# EAGLE design Control board self routed (EAGLE 9.6.2)
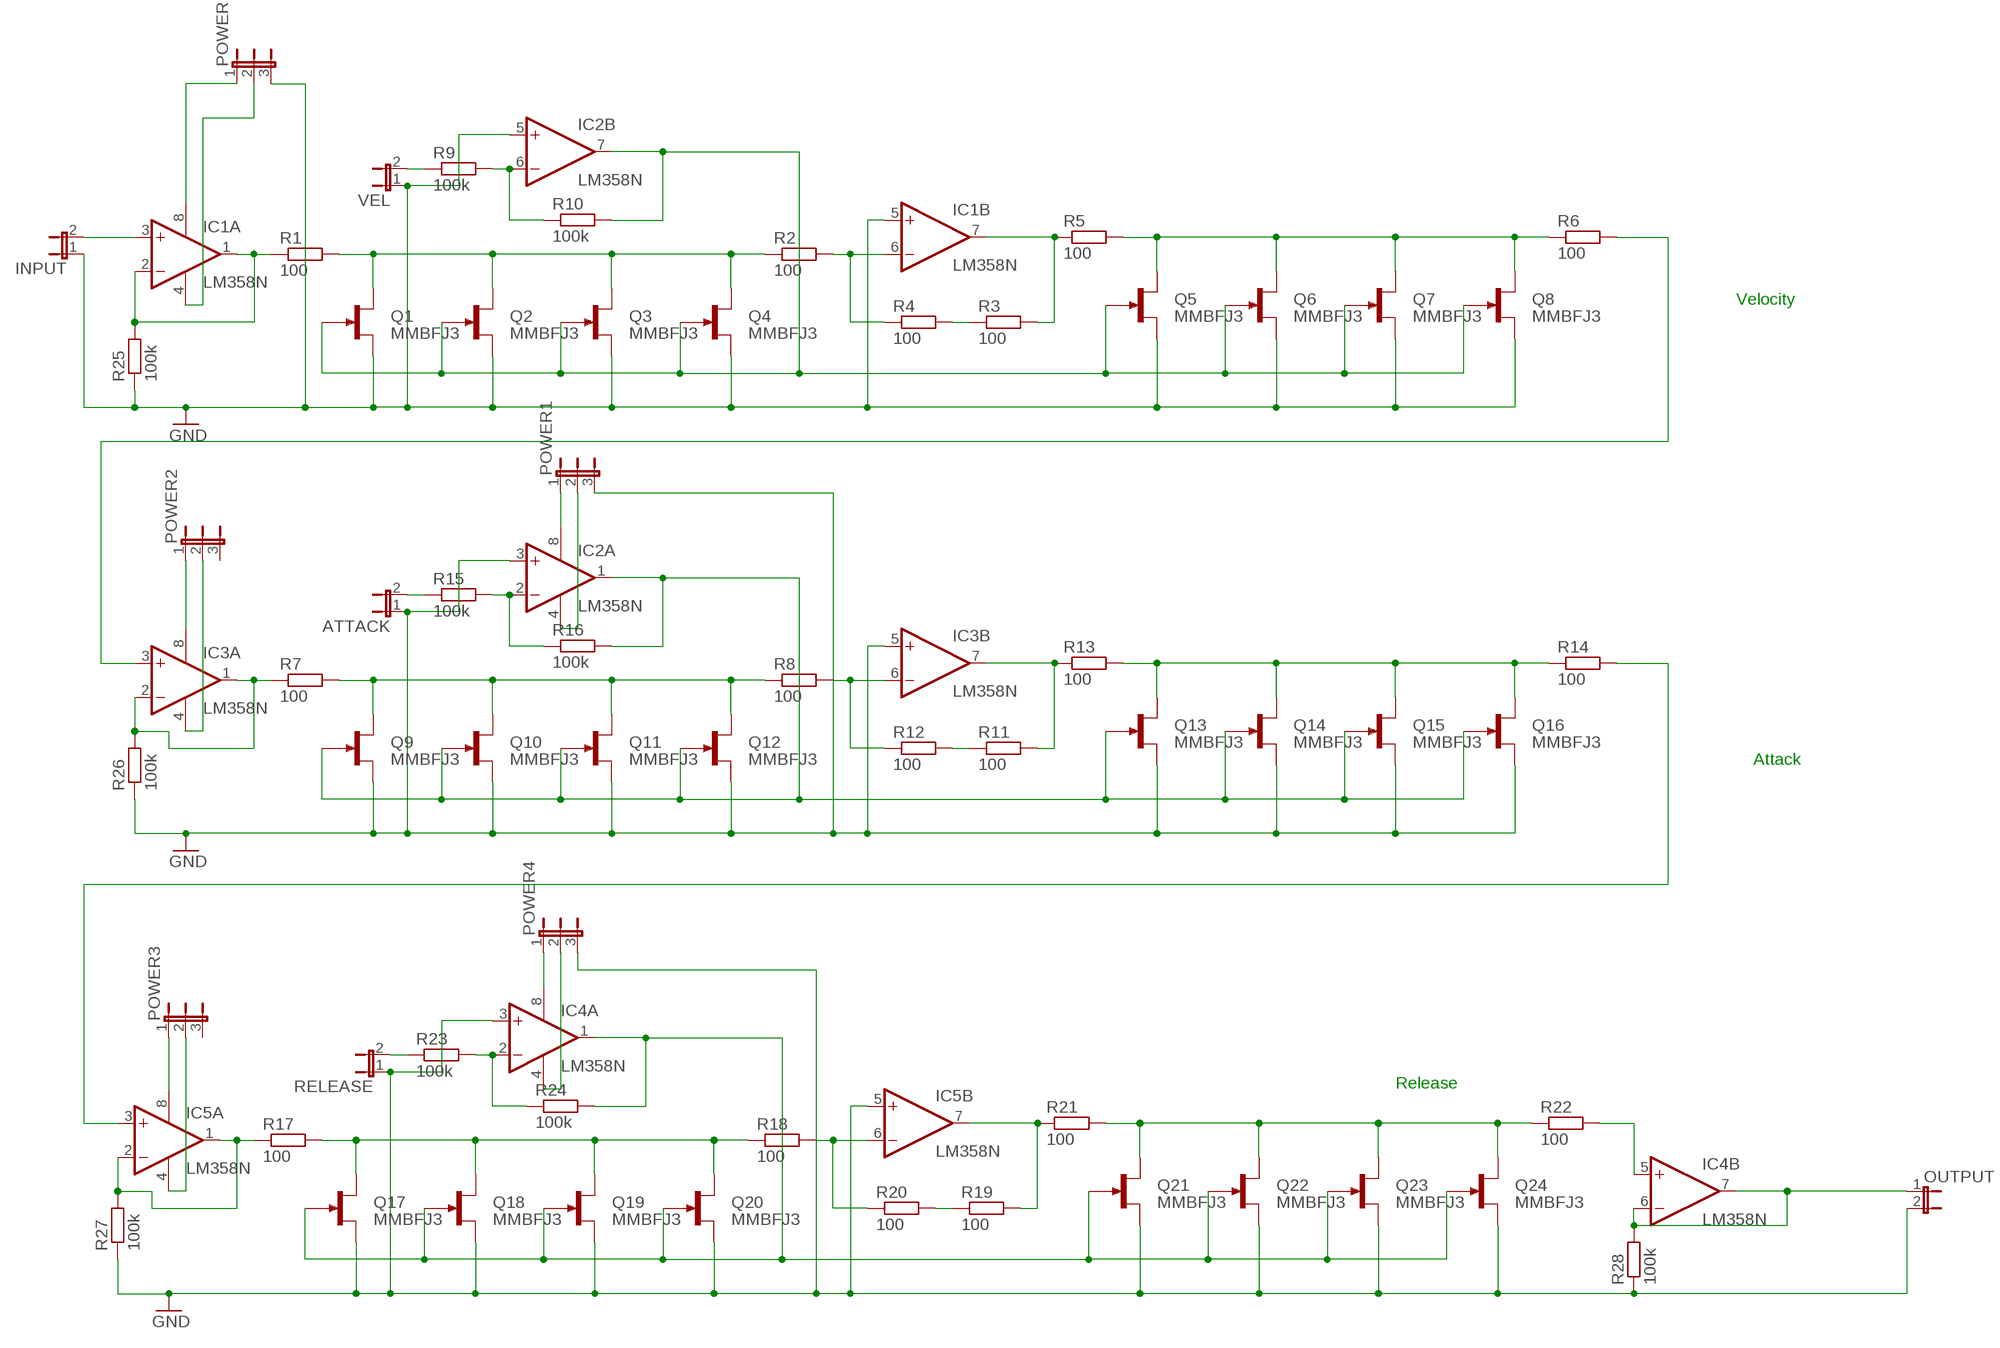
[diagram p0: schematic, sheet 1]

## Parts
ATTACK  JP1E  [JP1]
IC1  LM358N  [DIL08]
IC2  LM358N  [DIL08]
IC3  LM358N  [DIL08]
IC4  LM358N  [DIL08]
IC5  LM358N  [DIL08]
INPUT  JP1E  [JP1]
OUTPUT  JP1E  [JP1]
POWER  JP2E  [JP2]
POWER1  JP2E  [JP2]
POWER2  JP2E  [JP2]
POWER3  JP2E  [JP2]
POWER4  JP2E  [JP2]
Q1  MMBFJ3  [SOT23]
Q2  MMBFJ3  [SOT23]
Q3  MMBFJ3  [SOT23]
Q4  MMBFJ3  [SOT23]
Q5  MMBFJ3  [SOT23]
Q6  MMBFJ3  [SOT23]
Q7  MMBFJ3  [SOT23]
Q8  MMBFJ3  [SOT23]
Q9  MMBFJ3  [SOT23]
Q10  MMBFJ3  [SOT23]
Q11  MMBFJ3  [SOT23]
Q12  MMBFJ3  [SOT23]
Q13  MMBFJ3  [SOT23]
Q14  MMBFJ3  [SOT23]
Q15  MMBFJ3  [SOT23]
Q16  MMBFJ3  [SOT23]
Q17  MMBFJ3  [SOT23]
Q18  MMBFJ3  [SOT23]
Q19  MMBFJ3  [SOT23]
Q20  MMBFJ3  [SOT23]
Q21  MMBFJ3  [SOT23]
Q22  MMBFJ3  [SOT23]
Q23  MMBFJ3  [SOT23]
Q24  MMBFJ3  [SOT23]
R1  100  R-EU_0204/7  [0204/7]
R2  100  R-EU_0204/7  [0204/7]
R3  100  R-EU_0204/7  [0204/7]
R4  100  R-EU_0204/7  [0204/7]
R5  100  R-EU_0204/7  [0204/7]
R6  100  R-EU_0204/7  [0204/7]
R7  100  R-EU_0204/7  [0204/7]
R8  100  R-EU_0204/7  [0204/7]
R9  100k  R-EU_0204/7  [0204/7]
R10  100k  R-EU_0204/7  [0204/7]
R11  100  R-EU_0204/7  [0204/7]
R12  100  R-EU_0204/7  [0204/7]
R13  100  R-EU_0204/7  [0204/7]
R14  100  R-EU_0204/7  [0204/7]
R15  100k  R-EU_0204/7  [0204/7]
R16  100k  R-EU_0204/7  [0204/7]
R17  100  R-EU_0204/7  [0204/7]
R18  100  R-EU_0204/7  [0204/7]
R19  100  R-EU_0204/7  [0204/7]
R20  100  R-EU_0204/7  [0204/7]
R21  100  R-EU_0204/7  [0204/7]
R22  100  R-EU_0204/7  [0204/7]
R23  100k  R-EU_0204/7  [0204/7]
R24  100k  R-EU_0204/7  [0204/7]
R25  100k  R-EU_0204/7  [0204/7]
R26  100k  R-EU_0204/7  [0204/7]
R27  100k  R-EU_0204/7  [0204/7]
R28  100k  R-EU_0204/7  [0204/7]
RELEASE  JP1E  [JP1]
VEL  JP1E  [JP1]

## Nets
22: Q13.1(D) Q14.1(D) Q15.1(D) Q16.1(D) R13.2 R14.1
CONTROL: IC2.7(B:OUT) Q1.3(G) Q2.3(G) Q3.3(G) Q4.3(G) Q5.3(G) Q6.3(G) Q7.3(G) Q8.3(G) R10.2
CONTROL1: IC2.1(A:OUT) Q9.3(G) Q10.3(G) Q11.3(G) Q12.3(G) Q13.3(G) Q14.3(G) Q15.3(G) Q16.3(G) R16.2
CONTROL2: IC4.1(A:OUT) Q17.3(G) Q18.3(G) Q19.3(G) Q20.3(G) Q21.3(G) Q22.3(G) Q23.3(G) Q24.3(G) R24.2
GND: ATTACK.1 IC1.5(B:+IN) IC2.3(A:+IN) IC2.5(B:+IN) IC3.5(B:+IN) IC4.3(A:+IN) IC5.5(B:+IN) INPUT.1 OUTPUT.2 POWER1.3 POWER4.3 POWER.3 Q1.2(S) Q2.2(S) Q3.2(S) Q4.2(S) Q5.2(S) Q6.2(S) Q7.2(S) Q8.2(S) Q9.2(S) Q10.2(S) Q11.2(S) Q12.2(S) Q13.2(S) Q14.2(S) Q15.2(S) Q16.2(S) Q17.2(S) Q18.2(S) Q19.2(S) Q20.2(S) Q21.2(S) Q22.2(S) Q23.2(S) Q24.2(S) R25.1 R26.1 R27.1 R28.1 RELEASE.1 VEL.1
N$1: IC4.8(P:V+) POWER4.1
N$2: IC1.8(P:V+) POWER.1
N$3: IC1.6(B:-IN) R2.2 R4.1
N$4: IC1.1(A:OUT) IC1.2(A:-IN) R1.1 R25.2
N$5: R3.1 R4.2
N$6: IC4.4(P:V-) POWER4.2
N$7: IC1.7(B:OUT) R3.2 R5.1
N$8: R9.1 VEL.2
N$9: IC5.1(A:OUT) IC5.2(A:-IN) R17.1 R27.2
N$10: IC1.3(A:+IN) INPUT.2
N$11: IC5.8(P:V+) POWER3.1
N$12: IC2.6(B:-IN) R9.2 R10.1
N$13: IC4.6(B:-IN) IC4.7(B:OUT) OUTPUT.1 R28.2
N$14: IC5.4(P:V-) POWER3.2
N$15: IC3.6(B:-IN) R8.2 R12.1
N$16: R11.1 R12.2
N$17: IC3.7(B:OUT) R11.2 R13.1
N$18: IC3.8(P:V+) POWER2.1
N$19: IC4.5(B:+IN) R22.2
N$20: ATTACK.2 R15.1
N$21: IC2.2(A:-IN) R15.2 R16.1
N$22: IC3.4(P:V-) POWER2.2
N$23: IC2.8(P:V+) POWER1.1
N$24: IC1.4(P:V-) POWER.2
N$25: IC2.4(P:V-) POWER1.2
N$26: IC5.6(B:-IN) R18.2 R20.1
N$27: R19.1 R20.2
N$28: IC5.7(B:OUT) R19.2 R21.1
N$30: IC3.3(A:+IN) R6.2
N$31: R23.1 RELEASE.2
N$32: IC4.2(A:-IN) R23.2 R24.1
N$33: IC5.3(A:+IN) R14.2
N$34: IC3.1(A:OUT) IC3.2(A:-IN) R7.1 R26.2
NET11: Q1.1(D) Q2.1(D) Q3.1(D) Q4.1(D) R1.2 R2.1
NET12: Q5.1(D) Q6.1(D) Q7.1(D) Q8.1(D) R5.2 R6.1
NET21: Q9.1(D) Q10.1(D) Q11.1(D) Q12.1(D) R7.2 R8.1
NET31: Q17.1(D) Q18.1(D) Q19.1(D) Q20.1(D) R17.2 R18.1
NET32: Q21.1(D) Q22.1(D) Q23.1(D) Q24.1(D) R21.2 R22.1
Unconnected: POWER2.3 POWER3.3

## Notes on the sheet
- Velocity
- Attack
- Release

## Library data of the parts
ATTACK INPUT OUTPUT RELEASE VEL = jumper:JP1E: JUMPER
IC1-IC5 = linear:LM358: OP AMP also LM158; LM258; LM2904 Source: http://cache.national.com/ds/LM/LM158.pdf
POWER POWER1-POWER4 = jumper:JP2E: JUMPER
Q1-Q24 = transistor-small-signal:MMBFJ3*: N-Channel RF Amplifier Source: http://www.fairchildsemi.com/pf/J3/J310.html
R1-R28 = rcl:R-EU_: RESISTOR, European symbol; SPICEPREFIX: R

## Board
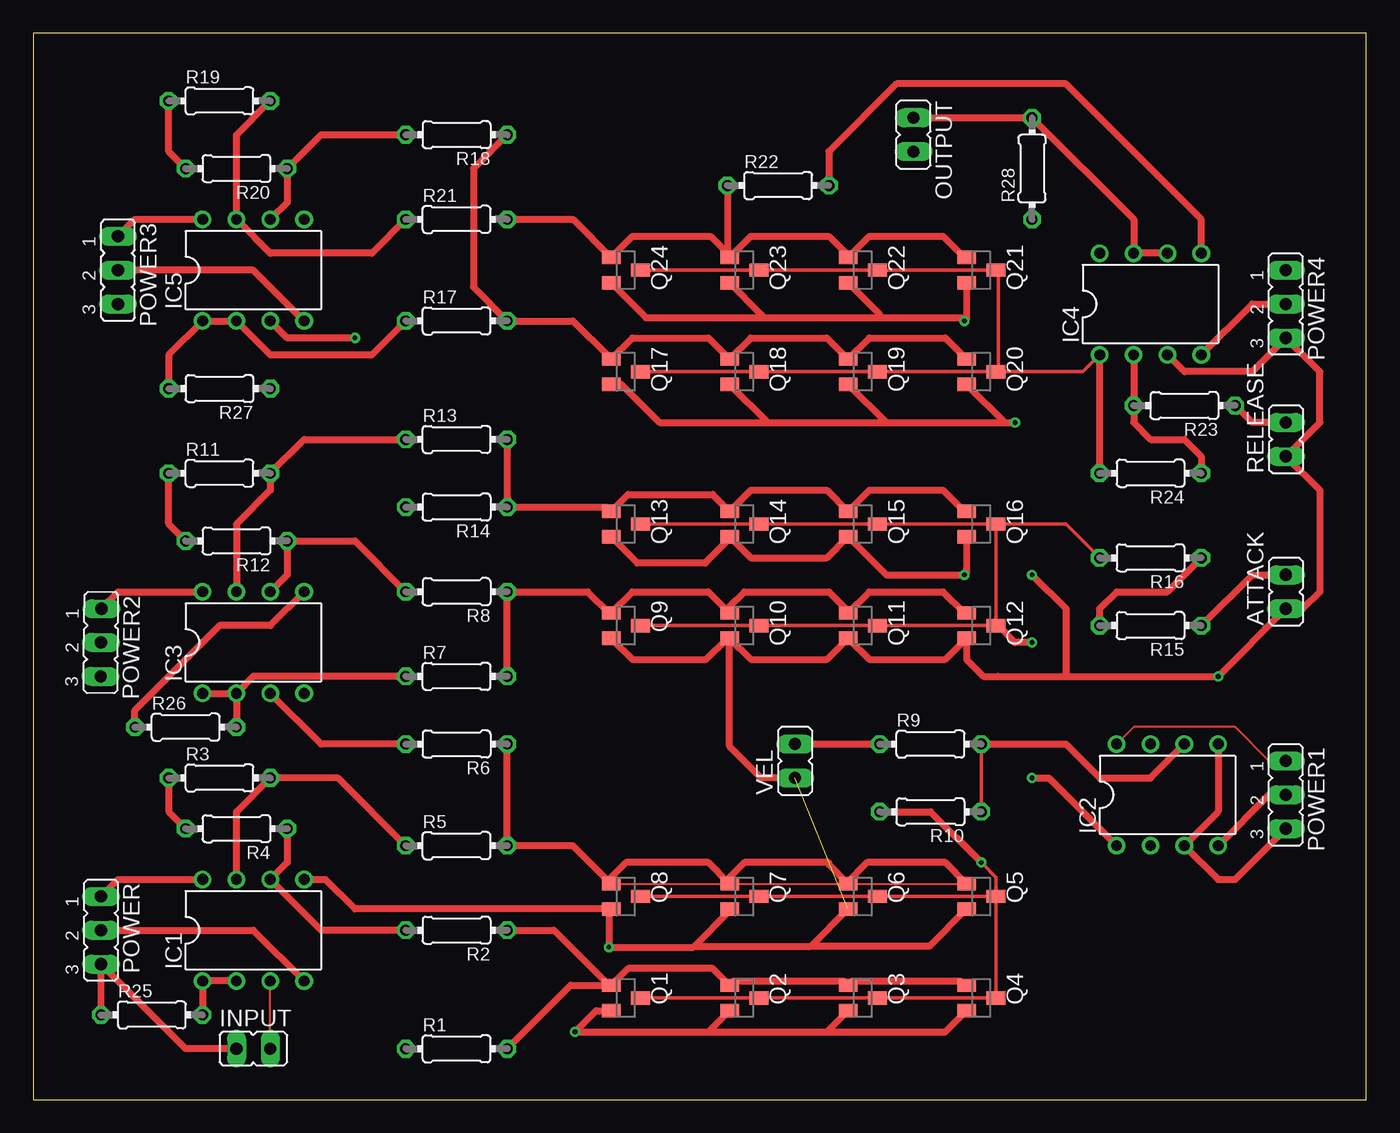
[diagram p1: board, top side]
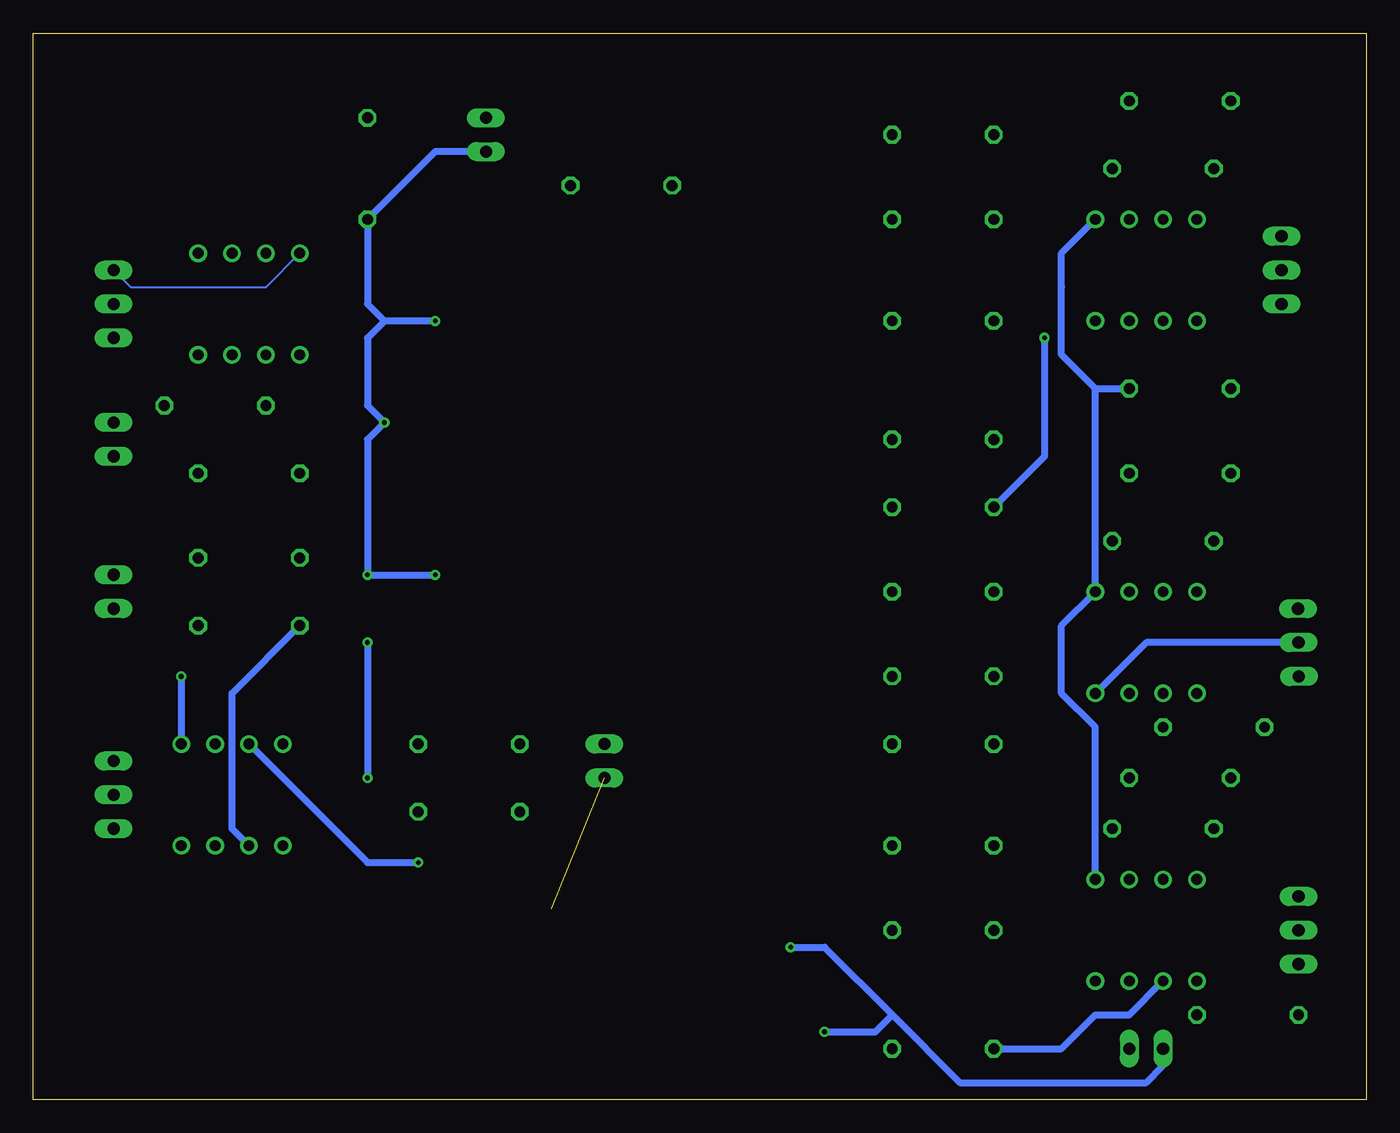
[diagram p2: board, bottom side, seen from below]

Size 100 x 80 mm. Coordinates in mm from the lower left corner, seen from the top.
Outline: 0,0 100,0 100,80 0,80 0,0
Copper layers (1*16): Top 0.035mm / dielectric 1.5mm / Bottom 0.035mm
Design rules "default": minimum track width 6mil, minimum drill 0.35mm, track to track 6mil, track to pad 6mil, pad to pad 6mil, via to via 6mil, smd to smd 6mil, copper to edge 40mil, drill to drill 6mil, minimum pad ring 10mil, minimum via ring 8mil, stop-mask expansion 4mil, vias tented up to drill 0mil, thermal gap 10mil

### Footprints (pad centres in the part's own frame; a part is rotated, then mirrored left to right if it is on the bottom)
JP1 = drill 0.914 long: 1 0,-1.27; 2 0,1.27
DIL08 = drill 0.813 pad 1.27: 1 -3.81,-3.81; 2 -1.27,-3.81; 3 1.27,-3.81; 4 3.81,-3.81; 5 3.81,3.81; 6 1.27,3.81; 7 -1.27,3.81; 8 -3.81,3.81
JP2 = drill 0.914 long: 1 -2.54,0; 2 0,0; 3 2.54,0
SOT23 = smd 1 x 1.4: 1 -0.95,-1.1; 2 0.95,-1.1; 3 0,1.1
0204/7 = drill 0.813 octagon: 1 -3.81,0; 2 3.81,0

### Placement (x,y rotation side)
ATTACK  93.98,38.1 0 top
IC1  16.51,12.7 0 top
IC2  85.09,22.86 0 top
IC3  16.51,34.29 0 top
IC4  83.82,59.69 0 top
IC5  16.51,62.23 0 top
INPUT  16.51,3.81 270 top
OUTPUT  66.04,72.39 180 top
POWER  5.08,12.7 270 top
POWER1  93.98,22.86 270 top
POWER2  5.08,34.29 269.4 top
POWER3  6.35,62.23 270 top
POWER4  93.98,59.69 270 top
Q1  44.45,7.62 270 top
Q2  53.34,7.62 270 top
Q3  62.23,7.62 270 top
Q4  71.12,7.62 270 top
Q5  71.12,15.24 270 top
Q6  62.23,15.24 270 top
Q7  53.34,15.24 270 top
Q8  44.45,15.24 270 top
Q9  44.45,35.56 270 top
Q10  53.34,35.56 270 top
Q11  62.23,35.56 270 top
Q12  71.12,35.56 270 top
Q13  44.45,43.18 270 top
Q14  53.34,43.18 270 top
Q15  62.23,43.18 270 top
Q16  71.12,43.18 270 top
Q17  44.45,54.61 270 top
Q18  53.34,54.61 270 top
Q19  62.23,54.61 270 top
Q20  71.12,54.61 270 top
Q21  71.12,62.23 270 top
Q22  62.23,62.23 270 top
Q23  53.34,62.23 270 top
Q24  44.45,62.23 270 top
R1  31.75,3.81 0 top
R2  31.75,12.7 180 top
R3  13.97,24.13 0 top
R4  15.24,20.32 180 top
R5  31.75,19.05 0 top
R6  31.75,26.67 180 top
R7  31.75,31.75 0 top
R8  31.75,38.1 180 top
R9  67.31,26.67 0 top
R10  67.31,21.59 180 top
R11  13.97,46.99 0 top
R12  15.24,41.91 180 top
R13  31.75,49.53 0 top
R14  31.75,44.45 180 top
R15  83.82,35.56 180 top
R16  83.82,40.64 180 top
R17  31.75,58.42 0 top
R18  31.75,72.39 180 top
R19  13.97,74.93 0 top
R20  15.24,69.85 180 top
R21  31.75,66.04 0 top
R22  55.88,68.58 0 top
R23  86.36,52.07 180 top
R24  83.82,46.99 180 top
R25  8.89,6.35 0 top
R26  11.43,27.94 0 top
R27  13.97,53.34 180 top
R28  74.93,69.85 90 top
RELEASE  93.98,49.53 0 top
VEL  57.15,25.4 0 top

### Tracks (layer width: path | path; a pad name or v marks a point on that pad's centre or on a via)
22
  Top 0.152: 69.85,44.13 Q16.1
  Top 0.508: R13.2 R14.1 43.03,44.45 Q13.1 44.62,45.4 50.97,45.4 Q14.1 53.83,45.72 59.54,45.72 Q15.1 62.72,45.72 68.26,45.72 69.85,44.13
CONTROL  (via drill 0.35)
  Top 0.152: 45.72,15.24 Q8.3 | 63.5,7.62 Q3.3
  Top 0.254: 63.5,7.62 Q4.3 Q5.3 | Q3.3 Q2.3 Q1.3 | Q5.3 Q6.3 Q7.3 45.72,15.24 | Q5.3 72.22,16.68 v71.12,17.78
  Top 0.508: R10.2 67.31,21.59 v71.12,17.78
  Bottom 0.508: IC2.7 74.93,17.78 v71.12,17.78
CONTROL1  (via drill 0.35)
  Top 0.152: Q9.3 Q10.3 54.61,35.56 Q11.3 | 63.5,43.18 Q15.3 | 72.39,35.56 Q12.3
  Top 0.254: Q9.3 54.61,35.56 | Q10.3 Q11.3 Q12.3 Q16.3 | Q16.3 63.5,43.18 | Q15.3 Q14.3 Q13.3 | Q16.3 77.47,43.18 R16.2
  Top 0.508: v74.93,34.29 73.66,34.29 72.39,35.56 | v74.93,24.13 76.2,24.13 IC2.1
  Bottom 0.508: v74.93,34.29 v74.93,24.13
CONTROL2
  Top 0.152: 72.39,54.61 Q20.3 | 45.72,54.61 Q17.3
  Top 0.254: IC4.1 78.74,54.61 72.39,54.61 72.39,62.06 Q21.3 Q22.3 Q23.3 Q24.3 | Q20.3 Q19.3 Q18.3 45.72,54.61
  Top 0.508: R24.2 IC4.1
GND  (via drill 0.35)  (1 unrouted)
  Top 0.152: POWER1.3 91.44,17.78 | 52.07,34.61 Q10.2 | 43.18,6.67 Q1.2 | 50.65,5.08 50.73,5.16 | 50.73,5.16 Q2.2 | 50.73,5.16 59.62,5.16 68.5,5.16 | Q3.2 60.88,6.42 | 49.53,11.43 58.27,11.43 58.34,11.51
  Top 0.508: INPUT.1 11.43,3.81 POWER.3 R25.1 | IC1.5 21.91,16.51 24.13,14.29 Q8.2 43.18,14.12 v43.18,11.43 49.53,11.43 49.6,11.51 | Q7.2 52.24,14.14 49.6,11.51 | 49.6,11.51 58.34,11.51 | Q6.2 58.34,11.51 | 58.34,11.51 67.23,11.51 Q5.2 | 43.18,6.67 42.23,6.67 v40.64,5.08 50.65,5.08 | Q2.2 50.65,5.08 | 50.65,5.08 59.54,5.08 | 59.54,5.08 59.62,5.16 60.88,6.42 | 59.54,5.08 68.43,5.08 68.5,5.16 Q4.2 | R26.1 7.62,29.21 13.97,35.56 17.78,35.56 IC3.5 | Q13.2 45.33,40.25 50.41,40.25 52.24,42.08 Q14.2 53.83,40.64 59.54,40.64 Q15.2 63.99,39.37 v69.85,39.37 70.02,39.54 Q16.2 | Q9.2 44.94,33.02 50.48,33.02 52.07,34.61 | VEL.1 54.61,24.13 52.24,26.5 Q10.2 53.83,33.02 59.54,33.02 Q11.2 62.72,33.02 68.43,33.02 Q12.2 70.02,33.02 71.29,31.75 72.39,31.75 77.47,31.75 | 77.47,31.75 v88.9,31.75 ATTACK.1 95.25,36.83 96.52,38.1 96.52,45.72 RELEASE.1 96.52,50.8 96.52,54.61 POWER4.3 91.44,54.61 86.36,54.61 IC4.3 | IC2.5 88.9,21.59 IC2.3 88.9,16.51 90.17,16.51 POWER1.3 | Q24.2 45.97,58.66 54.61,58.66 | 54.61,58.66 63.5,58.66 | 63.5,58.66 69.61,58.66 v69.85,58.42 70.02,58.59 Q21.2 | Q23.2 54.61,58.91 54.61,58.66 | Q22.2 63.5,58.91 63.5,58.66 | Q17.2 44.13,53.66 46.99,50.8 v73.66,50.8 | Q18.2 55.1,50.8 v73.66,50.8 | Q19.2 63.99,50.8 v73.66,50.8 | Q20.2 72.88,50.8 v73.66,50.8 | v74.93,39.37 77.47,36.83 77.47,31.75
  Bottom 0.152: POWER.3 6.35,10.16 | 22.86,57.15 22.86,60.96
  Bottom 0.508: OUTPUT.2 69.85,71.12 R28.1 74.93,59.69 73.66,58.42 | v69.85,58.42 73.66,58.42 | 73.66,58.42 74.93,57.15 74.93,52.07 v73.66,50.8 74.93,49.53 v74.93,39.37 v69.85,39.37 | v88.9,31.75 IC2.5 | v43.18,11.43 40.64,11.43 35.56,6.35 | 35.56,6.35 30.48,1.27 16.51,1.27 15.24,2.54 INPUT.1 | v40.64,5.08 36.83,5.08 35.56,6.35 | IC1.5 20.32,27.94 22.86,30.48 22.86,35.56 IC3.5 20.32,53.34 | 20.32,53.34 R27.1 | 20.32,53.34 22.86,55.88 22.86,60.96 22.86,63.5 IC5.5
N$1
  Bottom 0.152: POWER4.1 92.71,60.96 82.55,60.96 IC4.8
N$2
  Top 0.508: POWER.1 6.35,16.51 IC1.8
N$3
  Top 0.508: R2.2 21.59,12.7 IC1.6 19.05,17.78 R4.1
N$4
  Top 0.508: R25.2 IC1.1 IC1.2
  Bottom 0.508: R1.1 22.86,3.81 20.32,6.35 17.78,6.35 IC1.2
N$5
  Top 0.508: R3.1 10.16,21.59 R4.2
N$6
  Top 0.508: IC4.4 91.44,59.69 POWER4.2
N$7
  Top 0.508: IC1.7 15.24,21.59 R3.2 22.86,24.13 R5.1
N$8
  Top 0.508: VEL.2 R9.1
N$9
  Top 0.508: R27.2 10.16,55.88 IC5.1 IC5.2 17.78,55.88 25.4,55.88 R17.1
N$10
  Top 0.152: INPUT.2 IC1.3
N$11
  Top 0.508: POWER3.1 7.62,66.04 IC5.8
N$12
  Top 0.254: R10.1 R9.2
  Top 0.508: R9.2 77.47,26.67 80.01,24.13 83.82,24.13 IC2.6
N$13
  Top 0.508: IC4.6 IC4.7 82.55,66.04 R28.2 OUTPUT.1
N$14
  Top 0.508: IC5.4 16.51,62.23 POWER3.2
N$15
  Top 0.508: IC3.6 19.05,39.37 R12.1 24.13,41.91 R8.2
N$16
  Top 0.508: R11.1 10.16,43.18 R12.2
N$17
  Top 0.508: IC3.7 15.24,43.18 17.78,45.72 R11.2 20.32,49.53 R13.1
N$18
  Top 0.508: POWER2.1 6.38,38.1 IC3.8
N$19
  Top 0.508: IC4.5 87.63,66.04 77.47,76.2 64.77,76.2 59.69,71.12 R22.2
N$20
  Top 0.508: ATTACK.2 91.44,39.37 R15.1
N$21
  Top 0.508: R16.1 85.09,38.1 81.28,38.1 80.01,36.83 R15.2
  Bottom 0.508: R15.2 85.09,30.48 85.09,20.32 IC2.2
N$22
  Bottom 0.508: POWER2.2 16.51,34.29 IC3.4
N$23
  Top 0.152: POWER1.1 92.71,25.4 90.17,27.94 82.55,27.94 IC2.8
N$24
  Top 0.508: POWER.2 16.51,12.7 IC1.4
N$25
  Top 0.508: IC2.4 92.71,22.86 POWER1.2
N$26
  Top 0.508: R18.2 21.59,72.39 R20.1 19.05,67.31 IC5.6
N$27
  Top 0.508: R19.1 10.16,71.12 R20.2
N$28
  Top 0.152: R21.1 26.67,64.77 | 16.51,64.77 IC5.7
  Top 0.508: R21.1 25.4,63.5 17.78,63.5 IC5.7 15.24,72.39 R19.2
N$30
  Top 0.508: R6.2 21.59,26.67 IC3.3
N$31
  Top 0.508: RELEASE.2 91.44,50.8 R23.1
N$32
  Top 0.508: R24.1 87.63,48.26 86.36,49.53 83.82,49.53 82.55,50.8 R23.2 IC4.2
N$33  (via drill 0.35)
  Top 0.508: v24.13,57.15 19.05,57.15 IC5.3
  Bottom 0.508: v24.13,57.15 24.13,48.26 R14.2
N$34
  Top 0.508: IC3.2 R26.2 | IC3.1 IC3.2 | IC3.2 16.51,31.75 20.32,31.75 R7.1
NET11
  Top 0.152: 69.85,8.57 Q4.1
  Top 0.508: R1.2 40.32,8.57 43.18,8.57 | 43.18,8.57 Q1.1 44.62,9.84 50.97,9.84 Q2.1 52.56,8.89 60.81,8.89 Q3.1 61.45,8.89 69.53,8.89 69.85,8.57 | R2.1 39.05,12.7 43.18,8.57
NET12
  Top 0.152: Q8.1 52.07,16.19 Q7.1 60.96,16.19 Q6.1 Q5.1
  Top 0.508: Q5.1 68.43,17.78 62.55,17.78 60.96,16.19 | Q6.1 59.69,17.63 59.69,17.78 53.34,17.78 52.07,16.51 52.07,16.19 | Q7.1 50.65,17.78 44.45,17.78 43.35,16.68 Q8.1 40.49,19.05 R5.2 R6.1
NET21
  Top 0.152: 43.18,36.51 Q9.1 | 69.85,36.51 Q12.1
  Top 0.508: R7.2 R8.1 41.59,38.1 43.18,36.51 | Q9.1 44.94,38.1 50.65,38.1 Q10.1 52.24,37 53.34,38.1 59.69,38.1 61.13,36.66 Q11.1 62.72,38.1 68.26,38.1 69.85,36.51
NET31
  Top 0.152: 43.1,55.8 Q17.1
  Top 0.508: R18.1 33.02,69.85 33.02,60.96 R17.2 40.49,58.42 43.1,55.8 | Q17.1 44.94,57.15 50.65,57.15 Q18.1 53.83,57.15 59.54,57.15 Q19.1 62.72,57.15 68.43,57.15 Q20.1
NET32
  Top 0.152: 52.07,63.18 Q23.1 | 60.96,63.18 Q22.1 | 69.85,63.18 Q21.1
  Top 0.508: R21.2 40.49,66.04 Q24.1 44.94,64.77 50.8,64.77 52.07,63.5 | 52.07,63.5 52.07,63.18 | R22.1 52.07,63.5 | Q23.1 53.83,64.77 59.69,64.77 60.96,63.5 60.96,63.18 | Q22.1 62.72,64.77 68.26,64.77 69.85,63.18